# Altium schematic sheet plata_nizhn.SchDoc
size A4
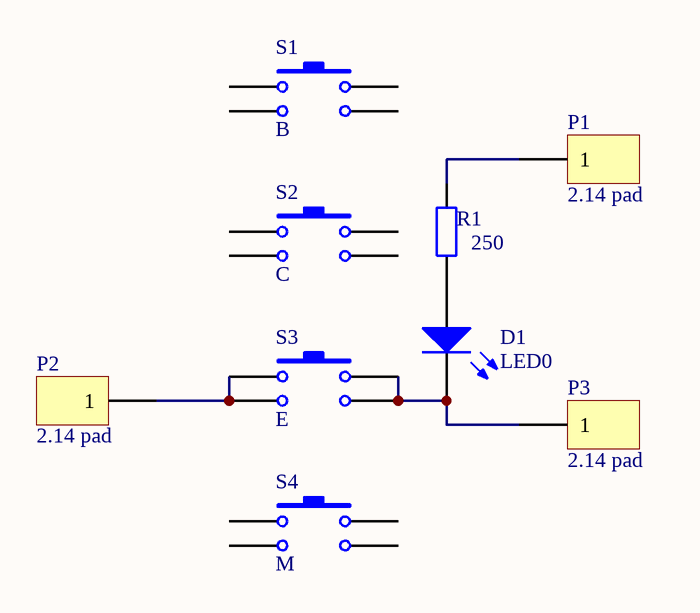
[diagram p0: plata_nizhn.SchDoc]

## Parts
D1  LED0  [LED0805]
P1  2.14 pad  [Pad]
P2  2.14 pad  [Pad]
P3  2.14 pad  [Pad]
R1  250  [6-0805_N]
S1  B  [STMW]
S2  C  [STMW]
S3  E  [STMW]
S4  M  [STMW]

## Nets
NetD1_1: D1.1(A) R1.1
NetD1_2: D1.2(K) P3.1 S3.2
NetP1_1: P1.1 R1.2
NetP2_1: P2.1 S3.1

Not connected (* = marked no-connect by the designer): S1 1 2; S2 1 2; S4 1 2

## Library data of the parts
D1 = LED0: Typical INFRARED GaAs LED; Published: 8-Jun-2000; LatestRevisionDate: 08-Jul-2005; LatestRevisionNote: Mech Layer 1 removed.; PackageReference: LED-0; Publisher: Altium Limited; PackageDescription: LED; 2 Leads
P1-P3 = 2.14 pad: pad; LatestRevisionDate: 17-Jul-2002; LatestRevisionNote: Re-released for DXP Platform.; Publisher: Altium Limited
R1 = Res2: Resistor; Value: 1K; Published: 8-Jun-2000; LatestRevisionDate: 17-Jul-2002; LatestRevisionNote: Re-released for DXP Platform.; PackageReference: AXIAL-0.4; Publisher: Altium Limited; PackageDescription: Axial Device, Thru-Hole; 2 Leads; 0.4 in Pin Spacing
S1-S4 = STMW: Switch; Published: 24-Mar-1999; LatestRevisionDate: 17-Jul-2002; LatestRevisionNote: Re-released for DXP Platform.; PackageReference: SPST-2; Publisher: Altium Limited; PackageDescription: Switch; 2 Leads